# EAGLE design magic-camper-node (EAGLE 5.12)
BOM: EXCLUDE; DATABASE: ./partsdb.txt; DESC: JUMPER; PARTNO: B2B-XH-A(LF)(SN)

## Sheet 1 of 5
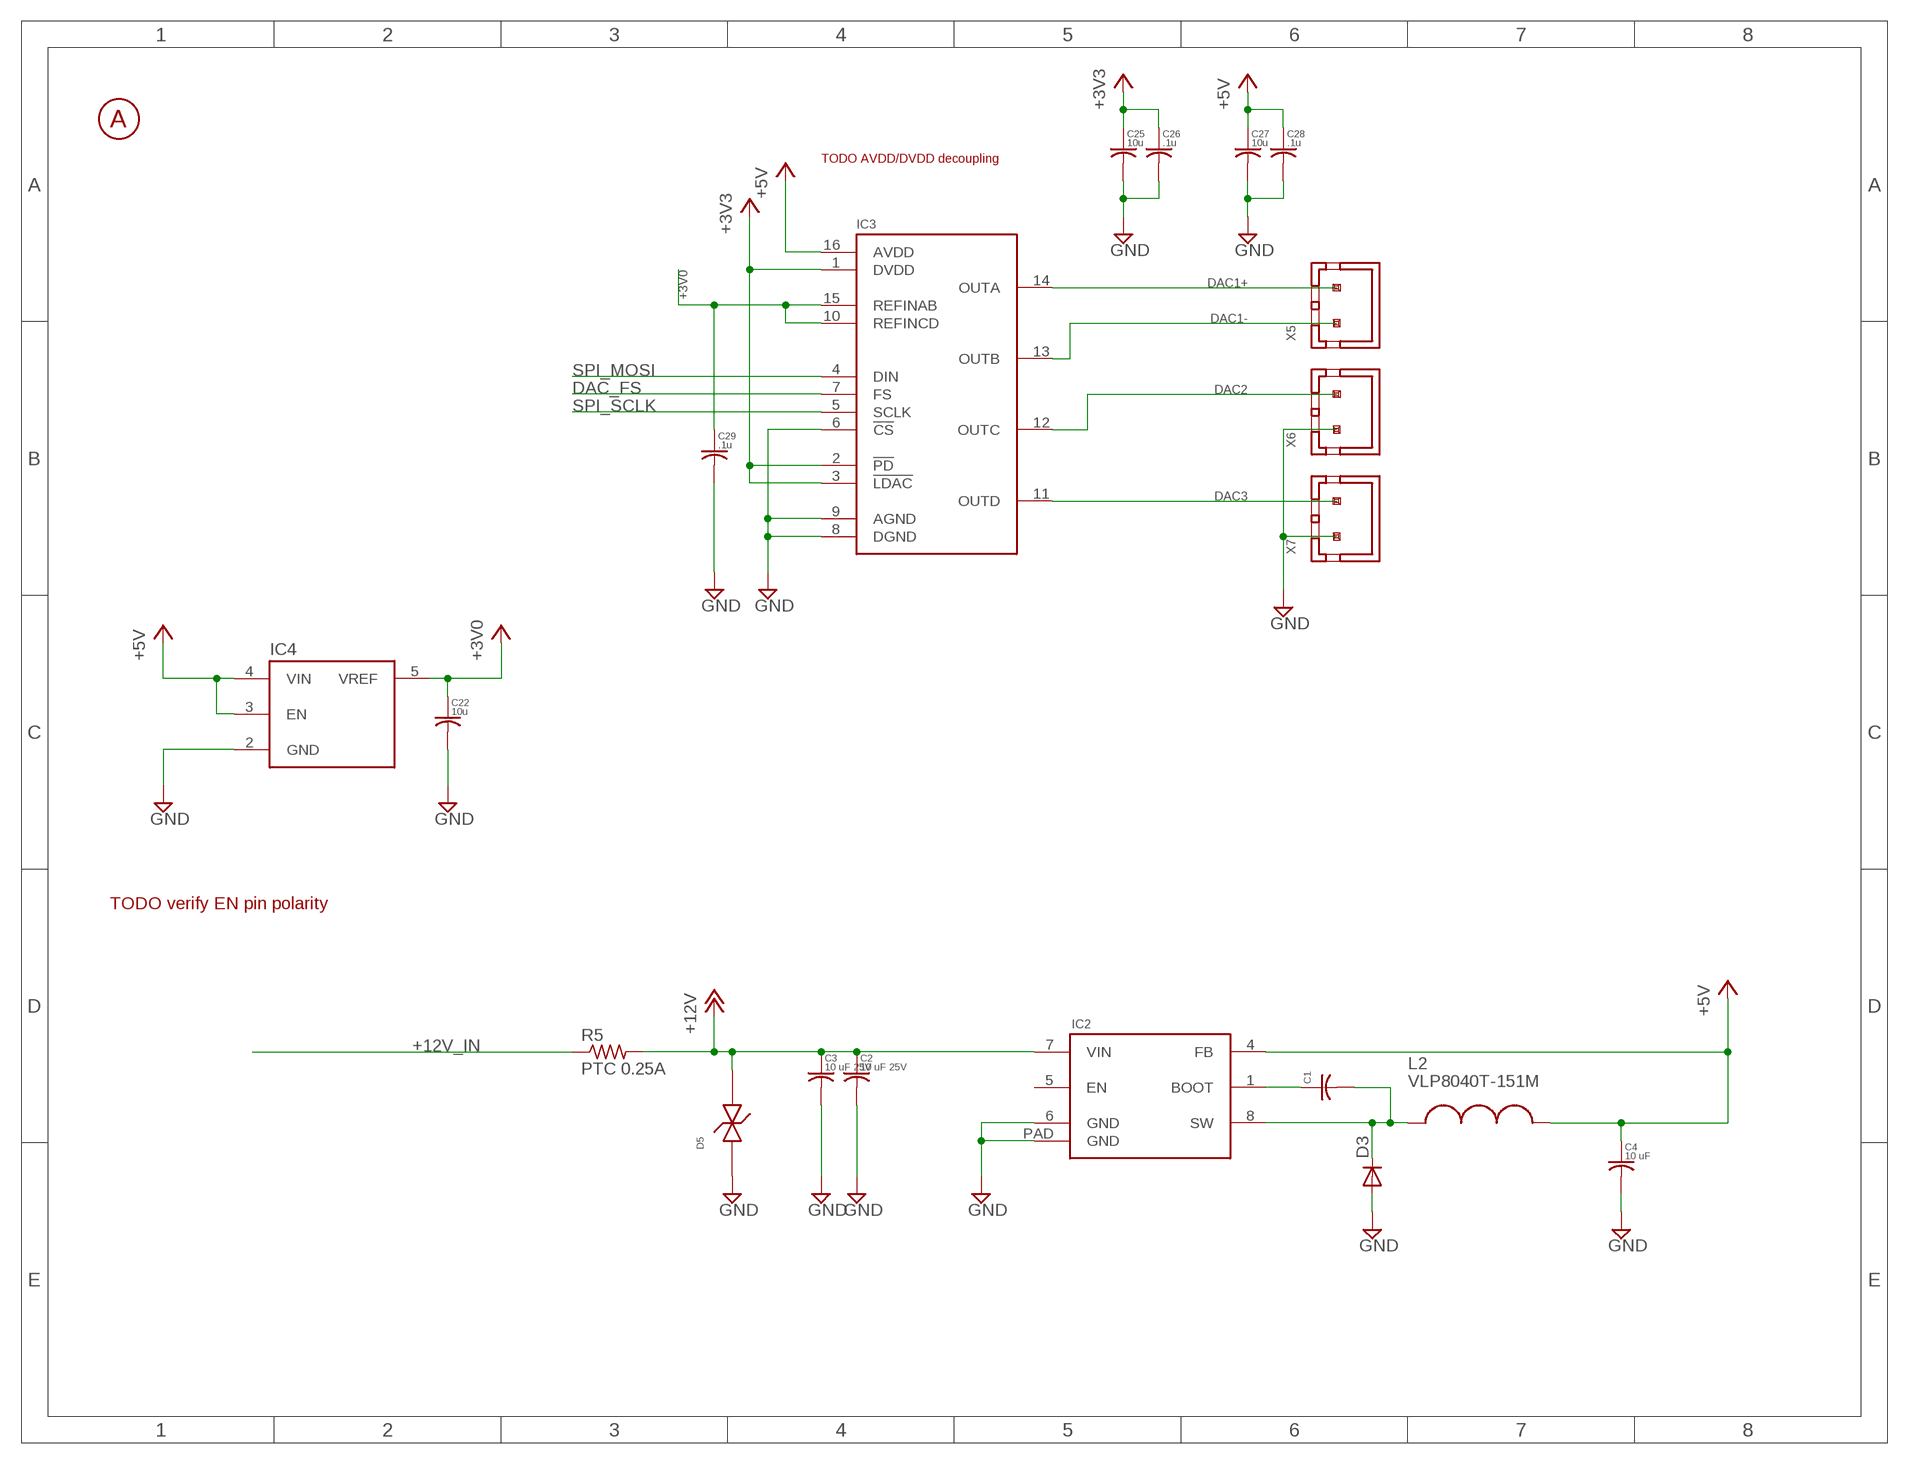
[diagram p0: schematic, sheet 1]

### Parts
C1  C-USC0805  [C0805]
C2  10 uF 25V  C-USC0805  [C0805]
C3  10 uF 25V  C-USC0805  [C0805]
C4  10 uF  C-USC0805  [C0805]
C22  10u  C-USC0805  [C0805]
C25  10u  C-USC0805  [C0805]
C26  .1u  C-USC0603  [C0603]
C27  10u  C-USC0805  [C0805]
C28  .1u  C-USC0603  [C0603]
C29  .1u  C-USC0603  [C0603]
D3  DIODE-SOD123  [SOD123]
D5  SMBJ30CA  [DO-214AA]
IC2  LM22674  [LM22674]
IC3  TLV5614  [SO-16]
IC4  LM4128  [SOT23-5]
L2  VLP8040T-151M  [VLP8040T-151M]
R5  PTC 0.25A  R-US_R0603  [R0603]
U$1  CIRCLE_A-0.3"  [CIRCLE_A-0.25"]
X5  XH-2CKT-VERT  [B2B-XH-A]
X6  XH-2CKT-VERT  [B2B-XH-A]
X7  XH-2CKT-VERT  [B2B-XH-A]

### Nets
+3V0: C22.1 C29.1 IC3.10(REFINCD) IC3.15(REFINAB) IC4.5(VREF) ; also sheet 4
+3V3: C25.1 C26.1 IC3.1(DVDD) IC3.2(!PD) IC3.3(!LDAC) ; also sheet 2,3
+5V: C4.1 C27.1 C28.1 IC2.4(FB) IC3.16(AVDD) IC4.3(EN) IC4.4(VIN) L2.2 ; also sheet 2,3,5
+12V: C2.1 C3.1 D5.2 IC2.7(VIN) R5.2
+12V_IN: R5.1 ; also sheet 3
DAC1+: IC3.14(OUTA) X5.2
DAC1-: IC3.13(OUTB) X5.1
DAC2: IC3.12(OUTC) X6.2
DAC3: IC3.11(OUTD) X7.2
DAC_FS: IC3.7(FS) ; also sheet 2
GND: C2.2 C3.2 C4.2 C22.2 C25.2 C26.2 C27.2 C28.2 C29.2 D3.A D5.1 IC2.6(GND) IC2.PAD(GND) IC3.6(!CS) IC3.8(DGND) IC3.9(AGND) IC4.2(GND) X6.1 X7.1 ; also sheet 2,3,4,5
N$6: C1.2 D3.C IC2.8(SW) L2.1
N$7: C1.1 IC2.1(BOOT)
SPI_MOSI: IC3.4(DIN) ; also sheet 2
SPI_SCLK: IC3.5(SCLK) ; also sheet 2
Unconnected: IC2.5(EN)

### Notes on the sheet
- TODO AVDD/DVDD decoupling
- TODO verify EN pin polarity

## Sheet 2 of 5
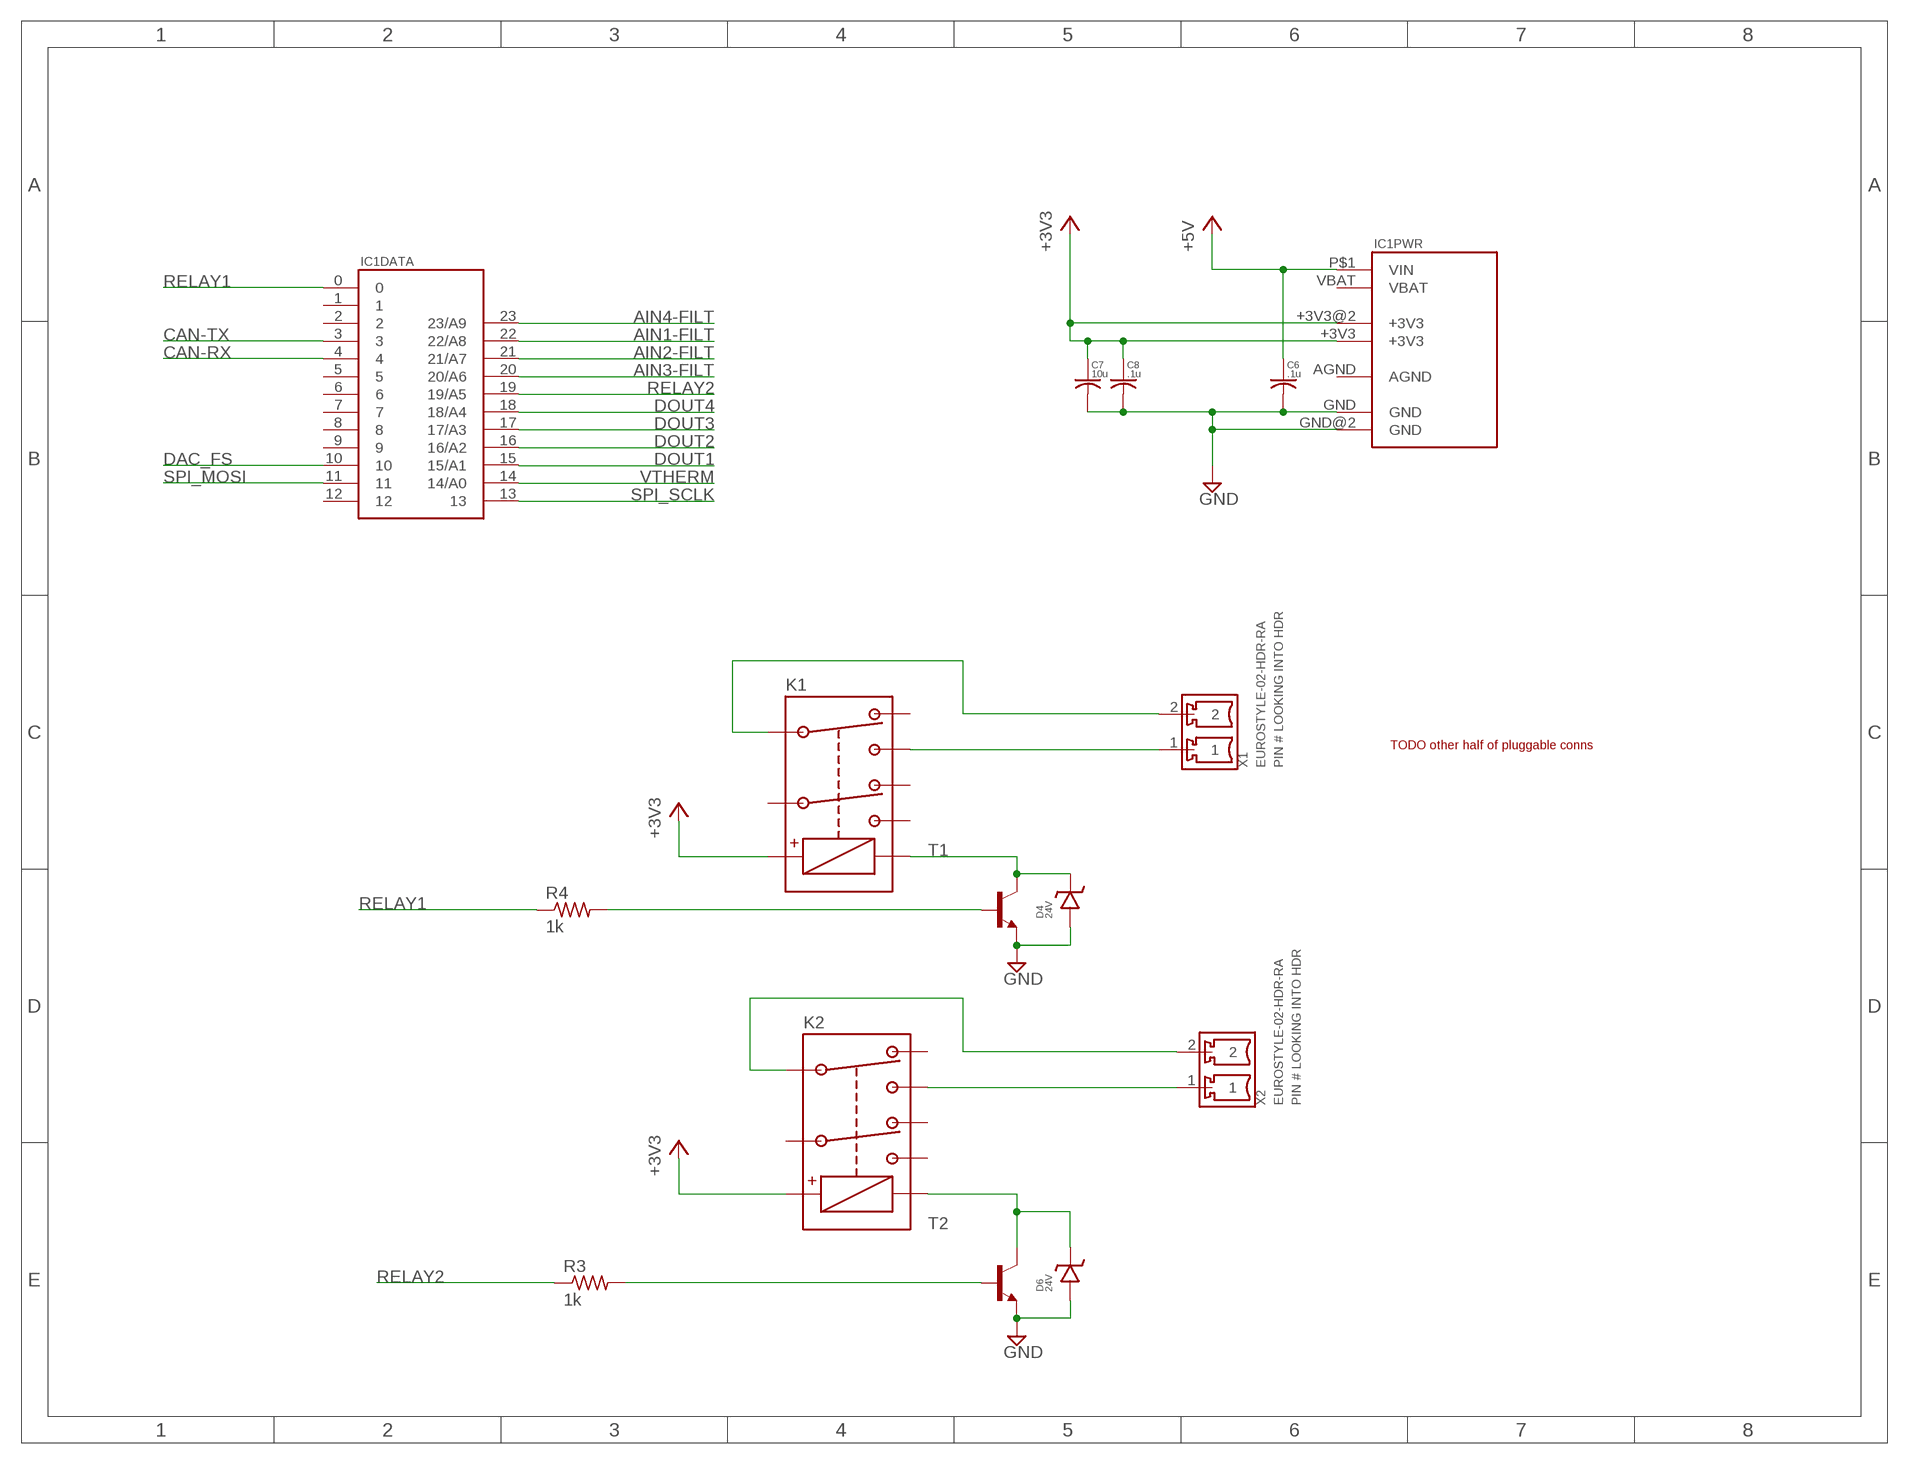
[diagram p1: schematic, sheet 2]

### Parts
C6  .1u  C-USC0603  [C0603]
C7  10u  C-USC0805  [C0805]
C8  .1u  C-USC0603  [C0603]
D4  24V  ZENER_DIODE-SOD-123  [SOD-123]
D6  24V  ZENER_DIODE-SOD-123  [SOD-123]
IC1  TEENSY-3.2  [TEENSY-3.2]
K1  TQ2SA-3V-Z  [TQ2SA-3V-Z]
K2  TQ2SA-3V-Z  [TQ2SA-3V-Z]
R3  1k  R-US_R0603  [R0603]
R4  1k  R-US_R0603  [R0603]
T1  MMBT3904LT1-NPN-SOT23-BEC  [SOT23-BEC]
T2  MMBT3904LT1-NPN-SOT23-BEC  [SOT23-BEC]
X1  EUROSTYLE-02-HDR-RA  [EUROSTYLE_HEADER-2CKT-RA]
X2  EUROSTYLE-02-HDR-RA  [EUROSTYLE_HEADER-2CKT-RA]

### Nets
+3V3: C7.1 C8.1 IC1.+3V3(PWR:+3V3) IC1.+3V3@2(PWR:+3V3) K1.1(COIL+) K2.1(COIL+) ; also sheet 1,3
+5V: C6.1 IC1.P$1(PWR:VIN) ; also sheet 1,3,5
AIN1-FILT: IC1.22(DATA:22/A8) ; also sheet 5
AIN2-FILT: IC1.21(DATA:21/A7) ; also sheet 5
AIN3-FILT: IC1.20(DATA:20/A6) ; also sheet 5
AIN4-FILT: IC1.23(DATA:23/A9) ; also sheet 5
CAN-RX: IC1.4 ; also sheet 3
CAN-TX: IC1.3 ; also sheet 3
DAC_FS: IC1.10 ; also sheet 1
DOUT1: IC1.15(DATA:15/A1) ; also sheet 4
DOUT2: IC1.16(DATA:16/A2) ; also sheet 4
DOUT3: IC1.17(DATA:17/A3) ; also sheet 4
DOUT4: IC1.18(DATA:18/A4) ; also sheet 4
GND: C6.2 C7.2 C8.2 D4.ANODE D6.ANODE IC1.GND(PWR:GND) IC1.GND@2(PWR:GND) T1.E T2.E ; also sheet 1,3,4,5
N$10: K1.3(COM1) X1.2
N$11: K1.4(NO1) X1.1
N$12: K2.3(COM1) X2.2
N$13: K2.4(NO1) X2.1
N$14: D6.CATHODE K2.10(COIL-) T2.C
N$15: D4.CATHODE K1.10(COIL-) T1.C
N$16: R4.2 T1.B
N$17: R3.2 T2.B
RELAY1: IC1.0 R4.1
RELAY2: IC1.19(DATA:19/A5) R3.1
SPI_MOSI: IC1.11 ; also sheet 1
SPI_SCLK: IC1.13 ; also sheet 1
VTHERM: IC1.14(DATA:14/A0) ; also sheet 4
Unconnected: IC1.1 IC1.2 IC1.5 IC1.6 IC1.7 IC1.8 IC1.9 IC1.12 IC1.AGND(PWR:AGND) IC1.RESET(PGM:RESET) IC1.VBAT(PWR:VBAT) K1.2(NC1) K1.7(NO2) K1.8(COM2) K1.9(NC2) K2.2(NC1) K2.7(NO2) K2.8(COM2) K2.9(NC2)

### Notes on the sheet
- TODO other half of pluggable conns

## Sheet 3 of 5
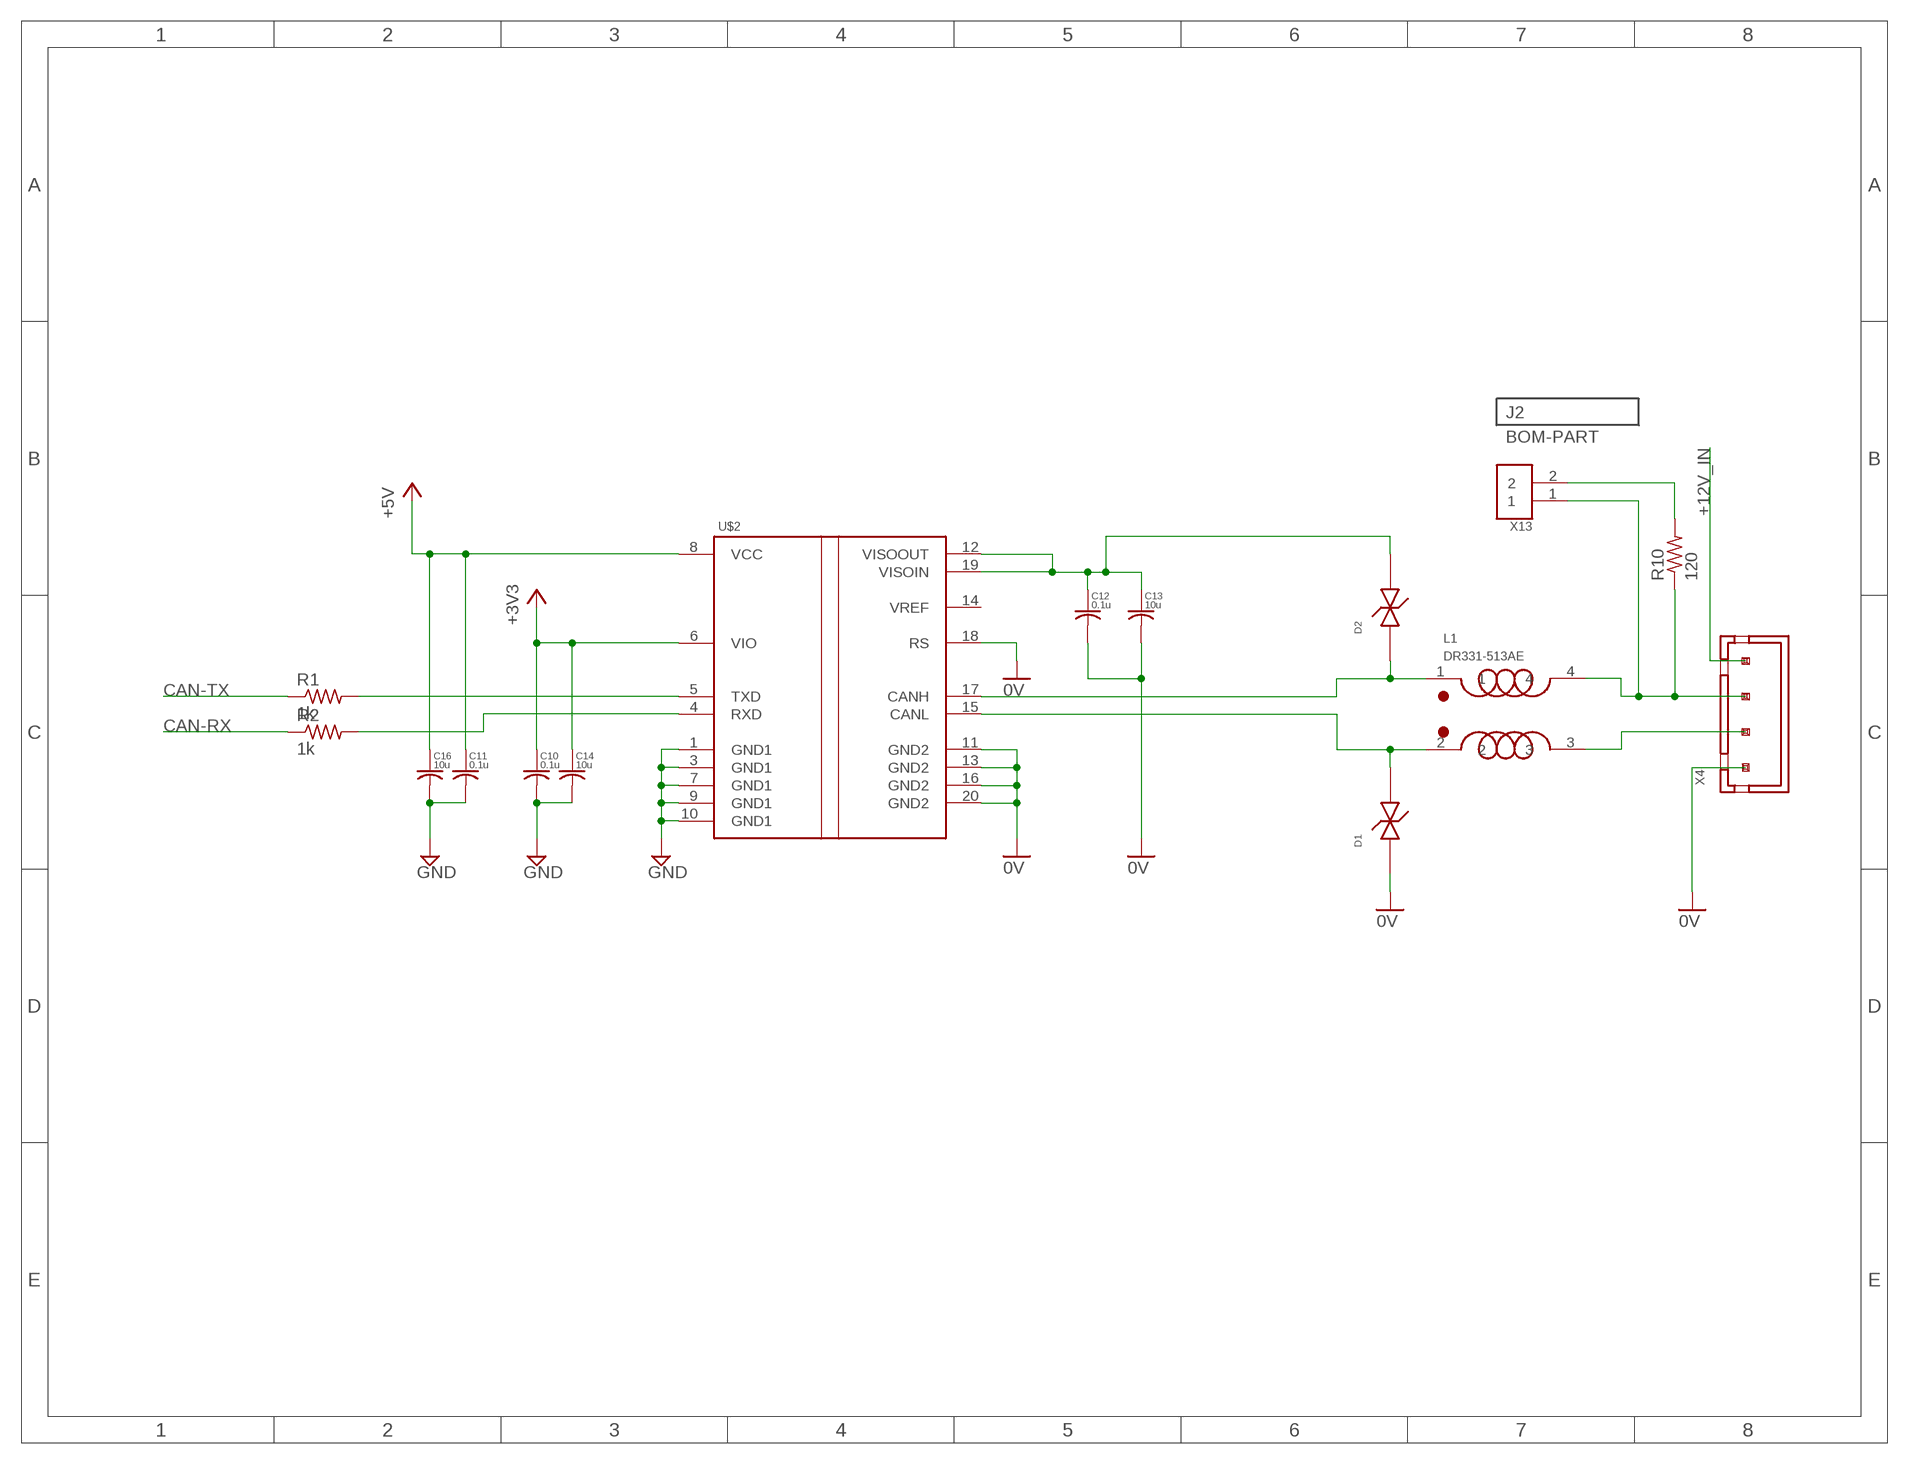
[diagram p2: schematic, sheet 3]
J2 (BOM-PART): BOM: INCLUDE; QTY: 1

### Parts
C10  0.1u  C-USC0603  [C0603]
C11  0.1u  C-USC0603  [C0603]
C12  0.1u  C-USC0603  [C0603]
C13  10u  C-USC0805  [C0805]
C14  10u  C-USC0805  [C0805]
C16  10u  C-USC0805  [C0805]
D1  SMBJ30CA  [DO-214AA]
D2  SMBJ30CA  [DO-214AA]
L1  DR331-513AE  [SMD]
R1  1k  R-US_R0603  [R0603]
R2  1k  R-US_R0603  [R0603]
R10  120  R-US_R0805  [R0805]
U$2  ADM3053  [SOIC-20]
X4  XH-4CKT-RA-THRU  [S4B-XH-A]
X13  MA02-1-0.05"  [HEADER_1.27_2POS]

### Nets
0V: C12.2 C13.2 D1.1 U$2.11(GND2) U$2.13(GND2) U$2.16(GND2) U$2.18(RS) U$2.20(GND2) X4.1
+3V3: C10.1 C14.1 U$2.6(VIO) ; also sheet 1,2
+5V: C11.1 C16.1 U$2.8(VCC) ; also sheet 1,2,5
+12V_IN: X4.4 ; also sheet 1
CAN-RX: R2.1 ; also sheet 2
CAN-TX: R1.1 ; also sheet 2
GND: C10.2 C11.2 C14.2 C16.2 U$2.1(GND1) U$2.3(GND1) U$2.7(GND1) U$2.9(GND1) U$2.10(GND1) ; also sheet 1,2,4,5
N$1: D2.1 L1.1 U$2.17(CANH)
N$2: D1.2 L1.2 U$2.15(CANL)
N$3: C12.1 C13.1 D2.2 U$2.12(VISOOUT) U$2.19(VISOIN)
N$4: R1.2 U$2.5(TXD)
N$5: R2.2 U$2.4(RXD)
N$8: L1.3 X4.2
N$9: L1.4 R10.1 X4.3 X13.1
N$18: R10.2 X13.2
Unconnected: U$2.14(VREF)

## Sheet 4 of 5
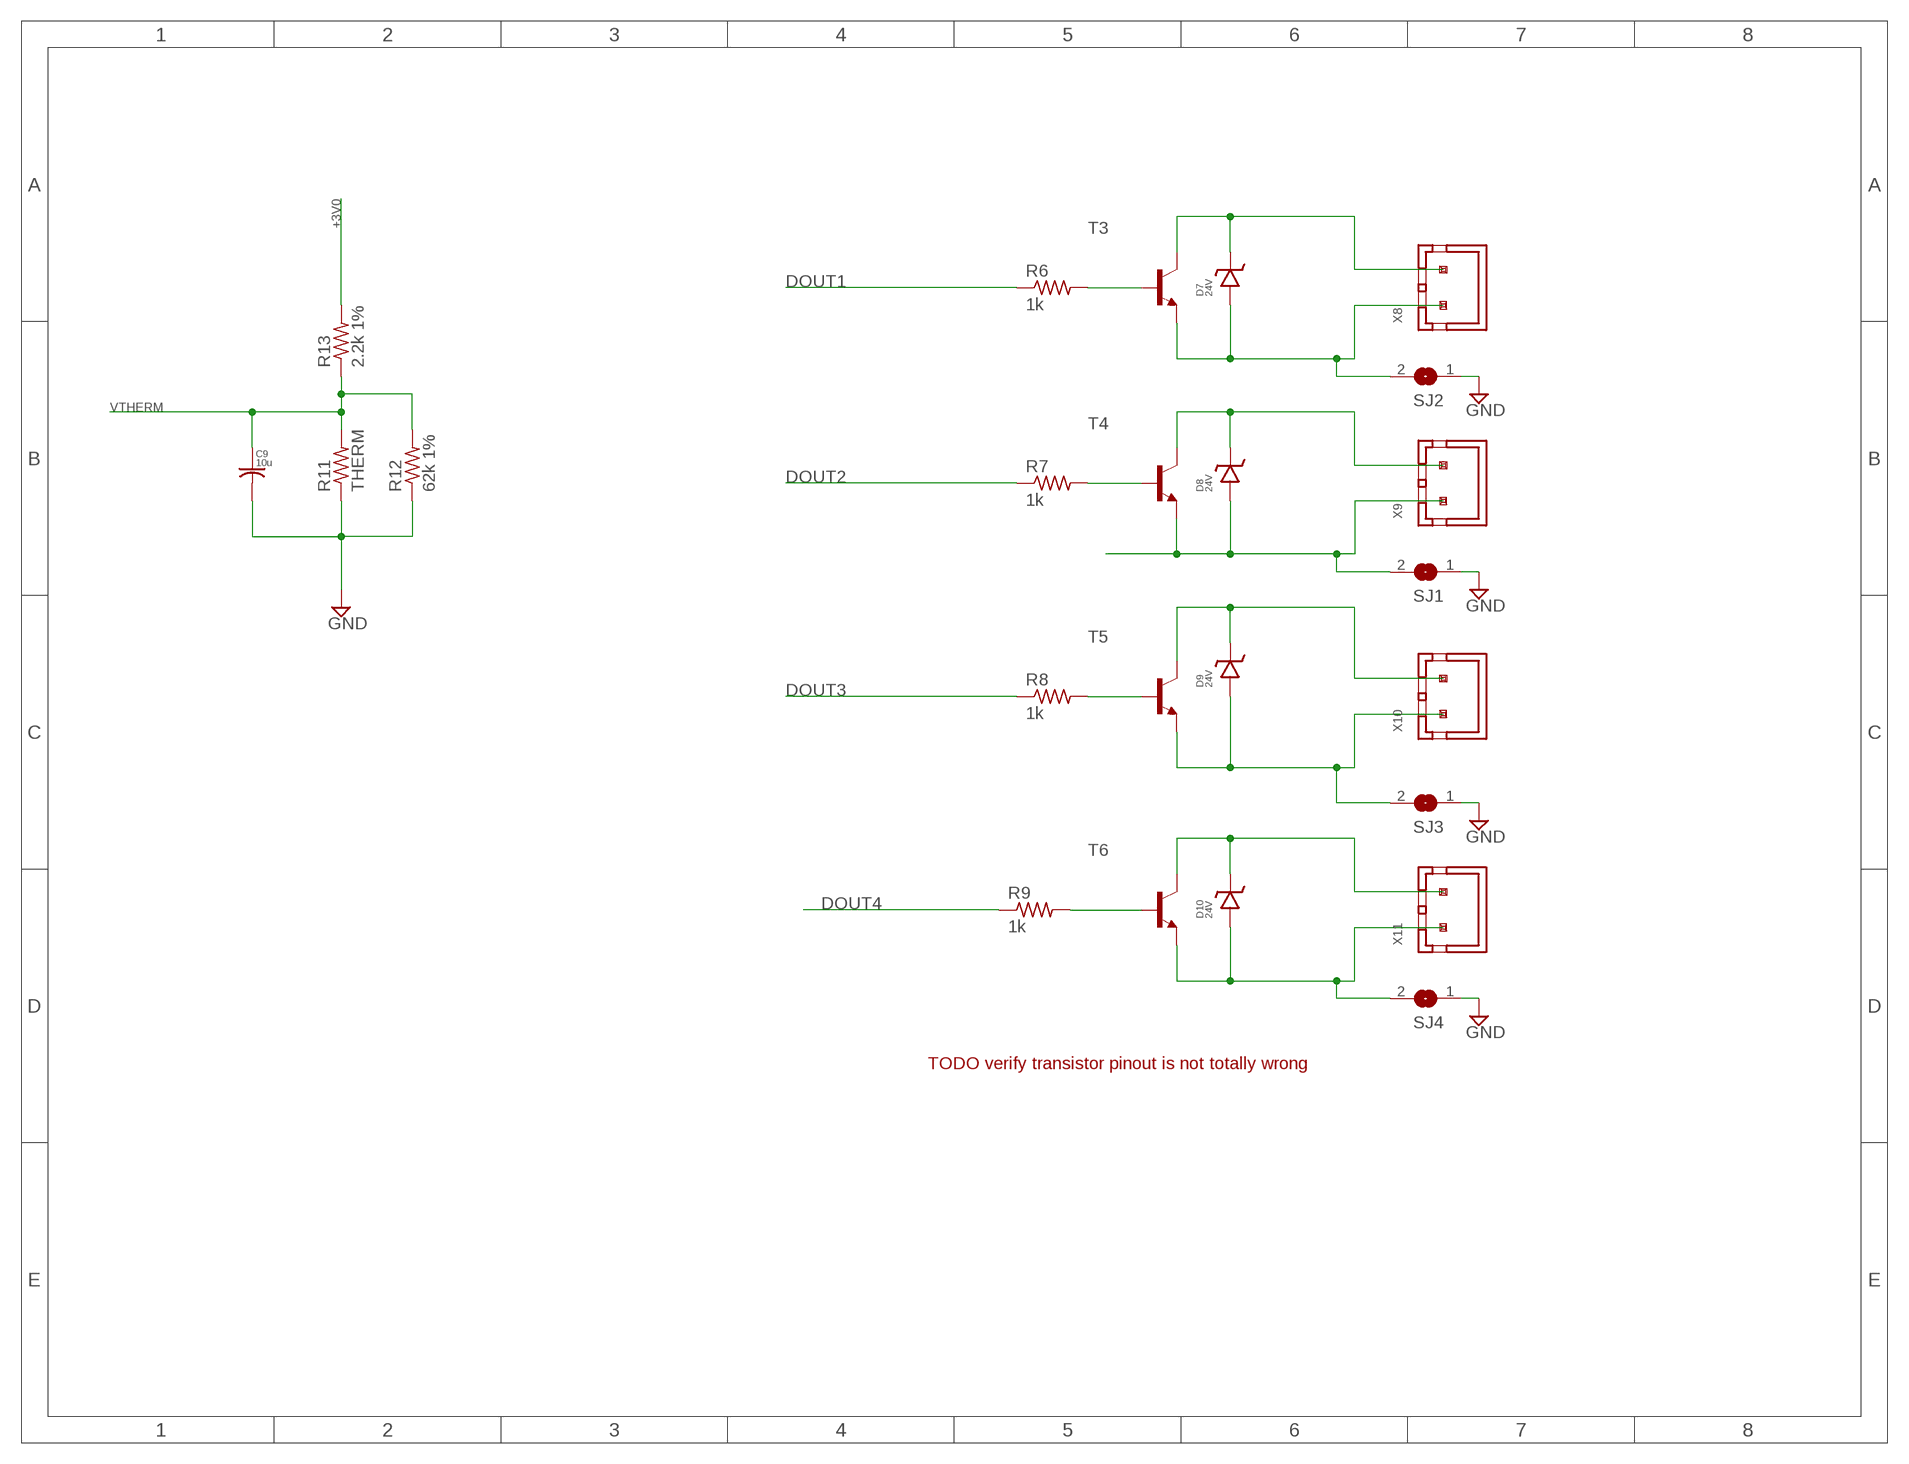
[diagram p3: schematic, sheet 4]

### Parts
C9  10u  C-USC0805  [C0805]
D7  24V  ZENER_DIODE-SOD-123  [SOD-123]
D8  24V  ZENER_DIODE-SOD-123  [SOD-123]
D9  24V  ZENER_DIODE-SOD-123  [SOD-123]
D10  24V  ZENER_DIODE-SOD-123  [SOD-123]
R6  1k  R-US_R0603  [R0603]
R7  1k  R-US_R0603  [R0603]
R8  1k  R-US_R0603  [R0603]
R9  1k  R-US_R0603  [R0603]
R11  THERM  R-US_R0603  [R0603]
R12  62k 1%  R-US_R0603  [R0603]
R13  2.2k 1%  R-US_R0603  [R0603]
SJ1  SJ  [SJ]
SJ2  SJ  [SJ]
SJ3  SJ  [SJ]
SJ4  SJ  [SJ]
T3  -NPN-SOT23-EBC  [SOT23-EBC]
T4  -NPN-SOT23-EBC  [SOT23-EBC]
T5  -NPN-SOT23-EBC  [SOT23-EBC]
T6  -NPN-SOT23-EBC  [SOT23-EBC]
X8  XH-2CKT-VERT  [B2B-XH-A]
X9  XH-2CKT-VERT  [B2B-XH-A]
X10  XH-2CKT-VERT  [B2B-XH-A]
X11  XH-2CKT-VERT  [B2B-XH-A]

### Nets
+3V0: R13.2 ; also sheet 1
DOUT1: R6.1 ; also sheet 2
DOUT2: R7.1 ; also sheet 2
DOUT3: R8.1 ; also sheet 2
DOUT4: R9.1 ; also sheet 2
GND: C9.2 R11.1 R12.1 SJ1.1 SJ2.1 SJ3.1 SJ4.1 ; also sheet 1,2,3,5
N$22: D7.CATHODE T3.C X8.2
N$23: D7.ANODE SJ2.2 T3.E X8.1
N$24: D8.CATHODE T4.C X9.2
N$25: D8.ANODE SJ1.2 T4.E X9.1
N$26: D9.CATHODE T5.C X10.2
N$27: D9.ANODE SJ3.2 T5.E X10.1
N$28: D10.CATHODE T6.C X11.2
N$29: D10.ANODE SJ4.2 T6.E X11.1
N$30: R6.2 T3.B
N$31: R7.2 T4.B
N$32: R8.2 T5.B
N$46: R9.2 T6.B
VTHERM: C9.1 R11.2 R12.2 R13.1 ; also sheet 2

### Notes on the sheet
- TODO verify transistor pinout is not totally wrong

## Sheet 5 of 5
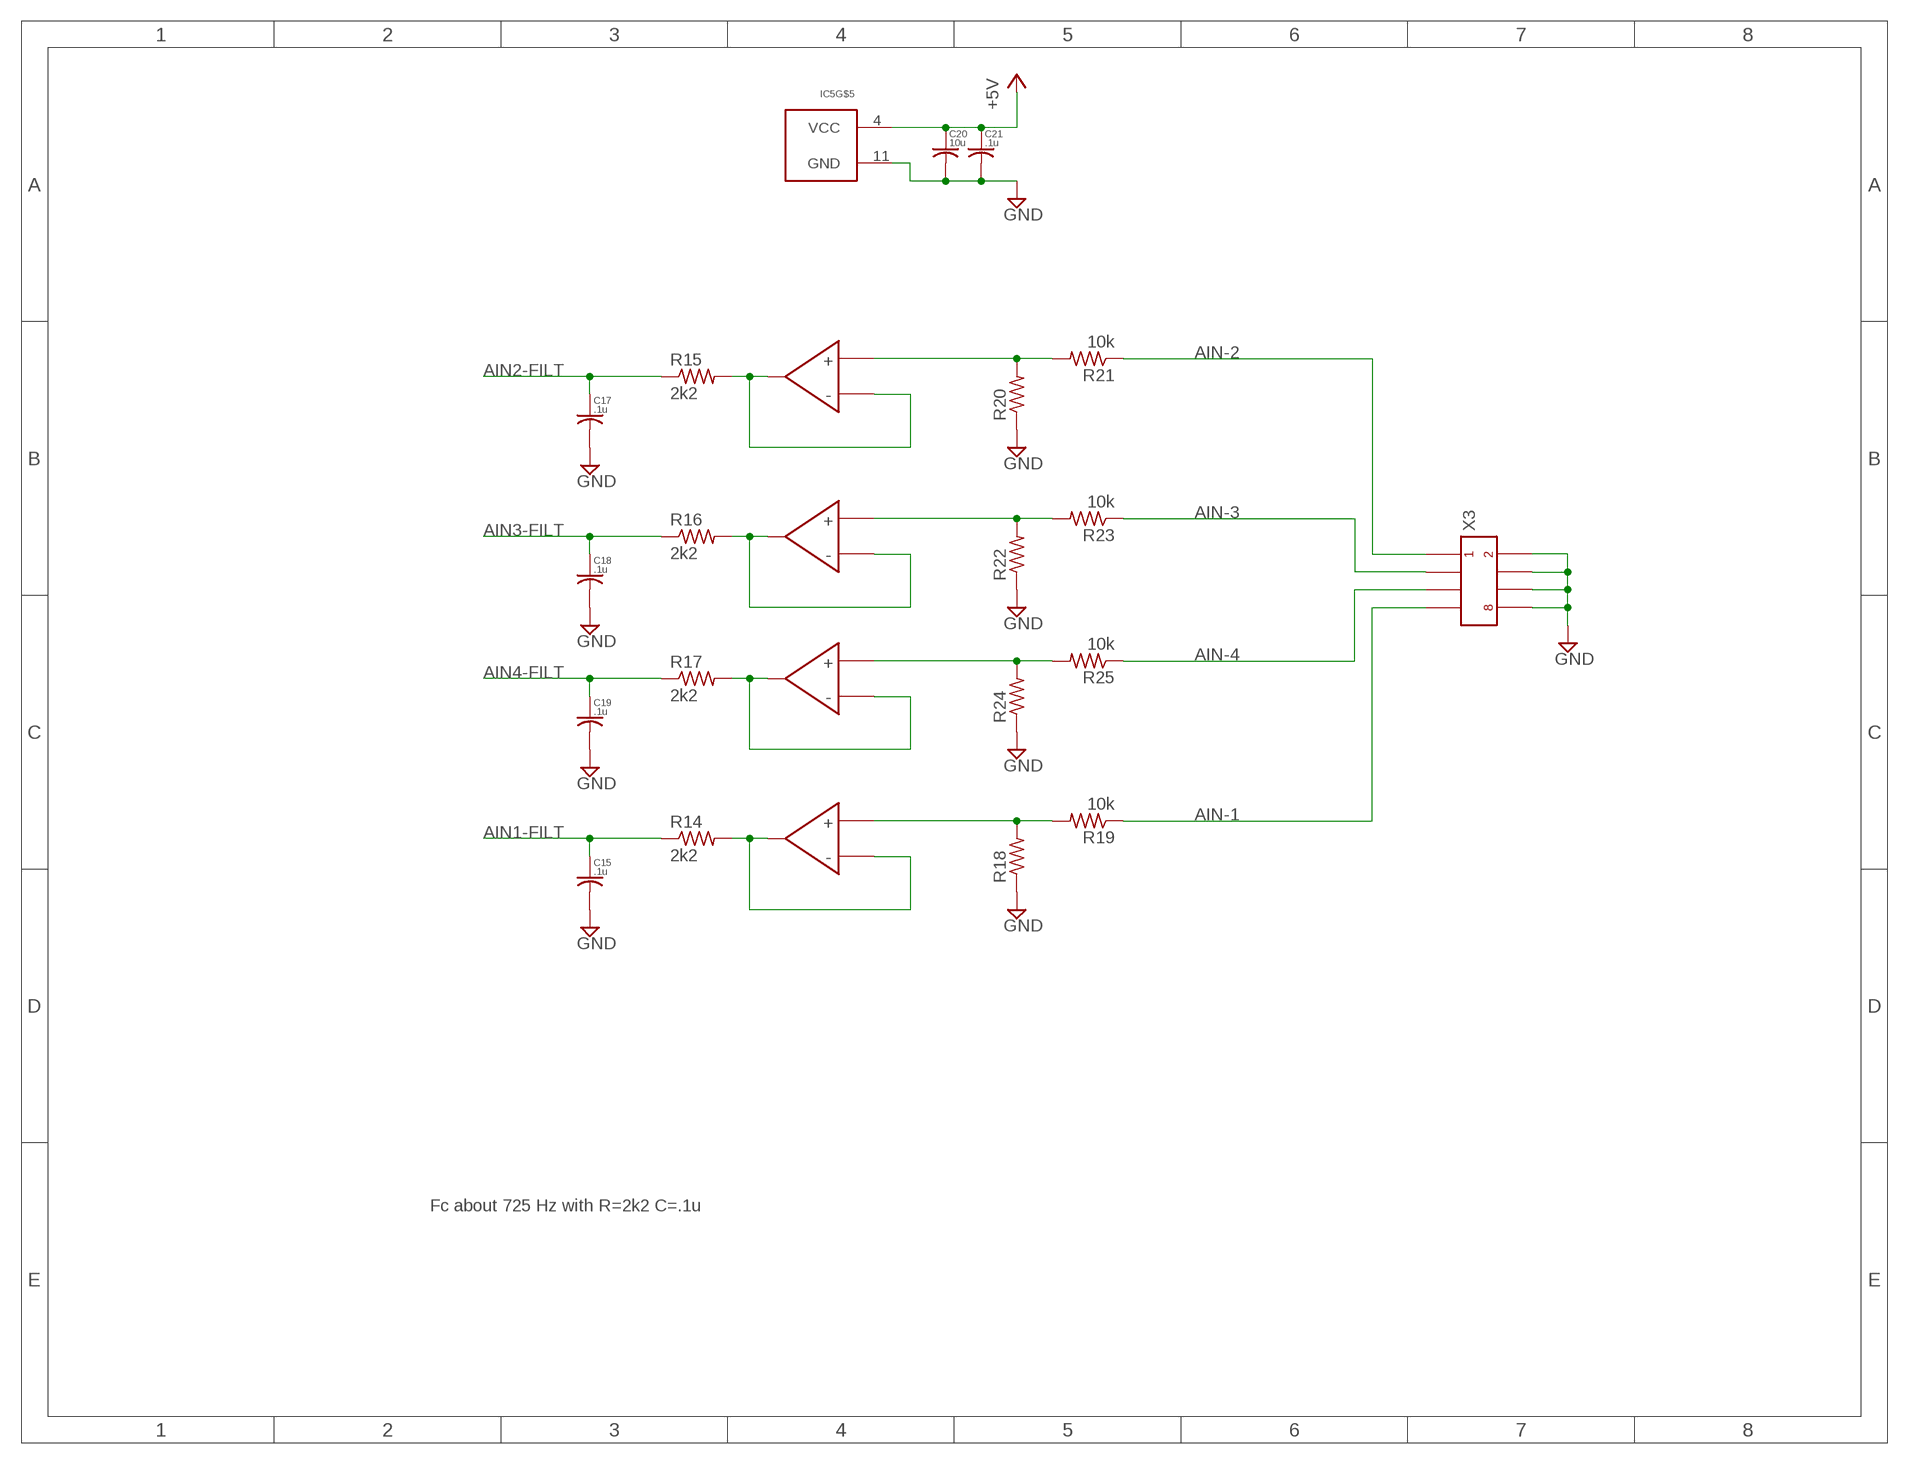
[diagram p4: schematic, sheet 5]

### Parts
C15  .1u  C-USC0603  [C0603]
C17  .1u  C-USC0603  [C0603]
C18  .1u  C-USC0603  [C0603]
C19  .1u  C-USC0603  [C0603]
C20  10u  C-USC0805  [C0805]
C21  .1u  C-USC0603  [C0603]
IC5  TLV2764IPWR  [PW_(R-PDSO-G14)_(TSSOP-14)]
R14  2k2  R-US_R0603  [R0603]
R15  2k2  R-US_R0603  [R0603]
R16  2k2  R-US_R0603  [R0603]
R17  2k2  R-US_R0603  [R0603]
R18  R-US_R0603  [R0603]
R19  10k  R-US_R0603  [R0603]
R20  R-US_R0603  [R0603]
R21  10k  R-US_R0603  [R0603]
R22  R-US_R0603  [R0603]
R23  10k  R-US_R0603  [R0603]
R24  R-US_R0603  [R0603]
R25  10k  R-US_R0603  [R0603]
X3  MALE-HEADER-8POS-2.54-RA-SHROUDED  [75867-132LF]

### Nets
+5V: C20.1 C21.1 IC5.4(VCC) ; also sheet 1,2,3
AIN1-FILT: C15.1 R14.1 ; also sheet 2
AIN2-FILT: C17.1 R15.1 ; also sheet 2
AIN3-FILT: C18.1 R16.1 ; also sheet 2
AIN4-FILT: C19.1 R17.1 ; also sheet 2
AIN-1: R19.1 X3.7
AIN-2: R21.1 X3.1
AIN-3: R23.1 X3.3
AIN-4: R25.1 X3.5
GND: C15.2 C17.2 C18.2 C19.2 C20.2 C21.2 IC5.11(GND) R18.1 R20.1 R22.1 R24.1 X3.2 X3.4 X3.6 X3.8 ; also sheet 1,2,3,4
N$19: IC5.6(IN-) IC5.7(OUT) R15.2
N$20: IC5.1(OUT) IC5.2(IN-) R14.2
N$21: IC5.12(IN+) R24.2 R25.2
N$34: IC5.8(OUT) IC5.9(IN-) R16.2
N$35: IC5.13(IN-) IC5.14(OUT) R17.2
N$36: IC5.10(IN+) R22.2 R23.2
N$37: IC5.5(IN+) R20.2 R21.2
N$38: IC5.3(IN+) R18.2 R19.2

### Notes on the sheet
- Fc about 725 Hz with R=2k2 C=.1u

## Library data of the parts
C1-C4 C6-C22 C25-C29 = rcl:C-US: CAPACITOR, American symbol
D1 D2 D5 = Littelfuse:SMBJ30CA: Bidirectional TVS Zener Diode 30V Breakdown http://www.digikey.com/product-detail/en/SMBJ30CA/SMBJ30CALFCT-ND/286112; PARTNO: SMBJ30CALFCT-ND
D3 = diode:DIODE-: DIODE
D4 D6-D10 = Diodes:ZENER_DIODE
IC1 = counter:TEENSY-3.2
IC2 = counter:LM22674
IC3 = magic-camper-node:TLV5614; PARTNO: TLV5614IPWR
IC4 = magic-camper-node:LM4128
IC5 = TI:TLV2764: TLV2764 - Micropower, Rail-to-Rail Input/Output Op-Amps with Shutdown Datasheet: http://www.ti.com/lit/ds/symlink/tlv2764.pdf; PARTNO: TLV2764IPWR
K1 K2 = magic-camper-node:TQ2SA-3V-Z; PARTNO: TQ2SA-3V-Z
L1 = Bourns:DR331-513AE: Bourns Common Mode Choke; PARTNO: DR331-513AECT-ND
L2 = counter:VLP8040T-151M; PARTNO: VLP8040T-151M
R1-R25 = rcl:R-US_: RESISTOR, American symbol
SJ1-SJ4 = jumper:SJ: SMD solder JUMPER
T1-T6 = transistor:*-NPN-: NPN Transistror BF959 corrected 2008.03.06
U$1 = magic-camper-node:CIRCLE_A
U$2 = counter:ADM3053
X1 X2 = Molex:EUROSTYLE-02-HDR: Eurostyle (tm) 3.50mm Pitch PCB Header, 2 Circuits This is the pluggable screw terminal block that Molex makes (like on the BQ76PL536 EVM boards). Molex series number: 39502 (horizontal header), 39501 (vertical header) Mates with: 39500 horizontal plug, 39503 vertical plug Website (horizontal header): http://www.molex.com/molex/products/datasheet.jsp?part=active/0395021002_TERMINAL_BLOCKS.xml Website (vertical header): http://www.molex.com/molex/products/datasheet.jsp?part=active/0395011002_TERMINAL_BLOCKS.xml Datasheet: http://www.molex.com/pdm_docs/sd/395021006_sd.pdf <http://www.molex.com/pdm_docs/sd/395021004_sd.pdf>
X3 = magic-camper-node:MALE-HEADER-8POS; PARTNO: 75867-132LF
X4 = JST:XH-4CKT: XH connector, 4 circuits Datasheet: http://www.jst-mfg.com/product/pdf/eng/eXH.pdf; PARTNO: S4B-XH-A
X5-X11 = JST:XH-2CKT: XH connector, 2 circuits Datasheet: http://www.jst-mfg.com/product/pdf/eng/eXH.pdf Mating connector: XHP-2 Terminals: SXH-001T-P0.6 (28-22awg) SXH-002T-P0.6 (30-26awg); PARTNO: B2B-XH-A
X13 = magic-camper-node:MA02-1; PARTNO: GRPB021VWVN-RC

## Board
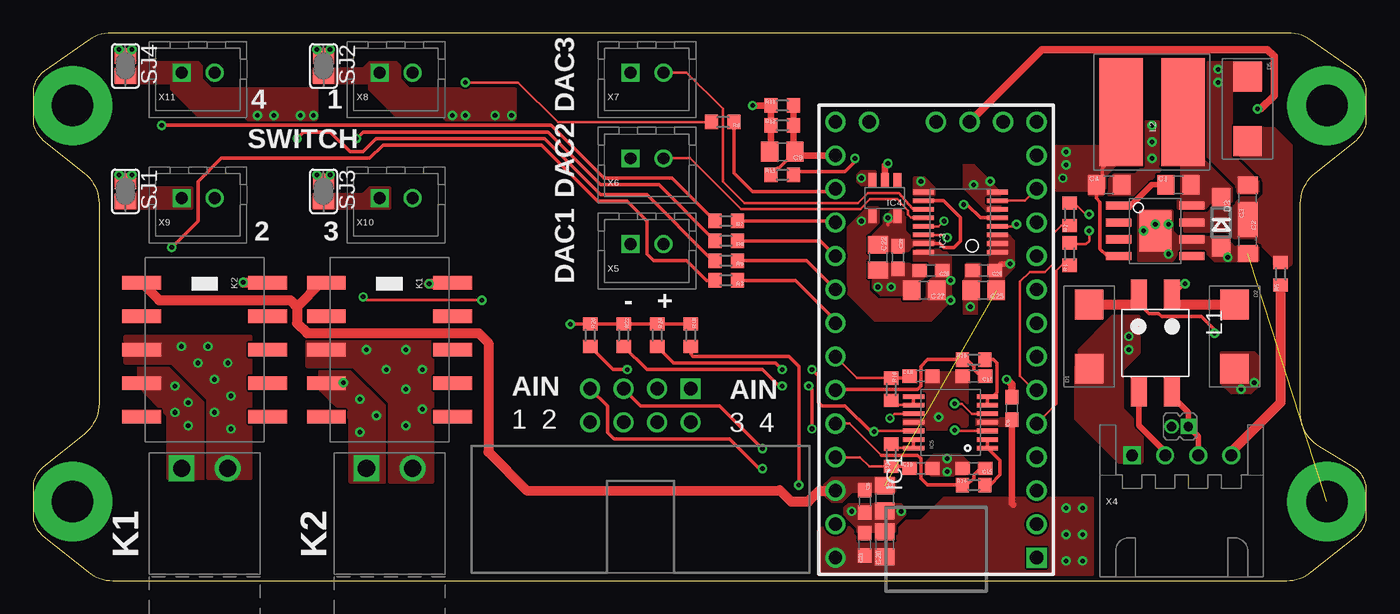
[diagram p5: board, top side]
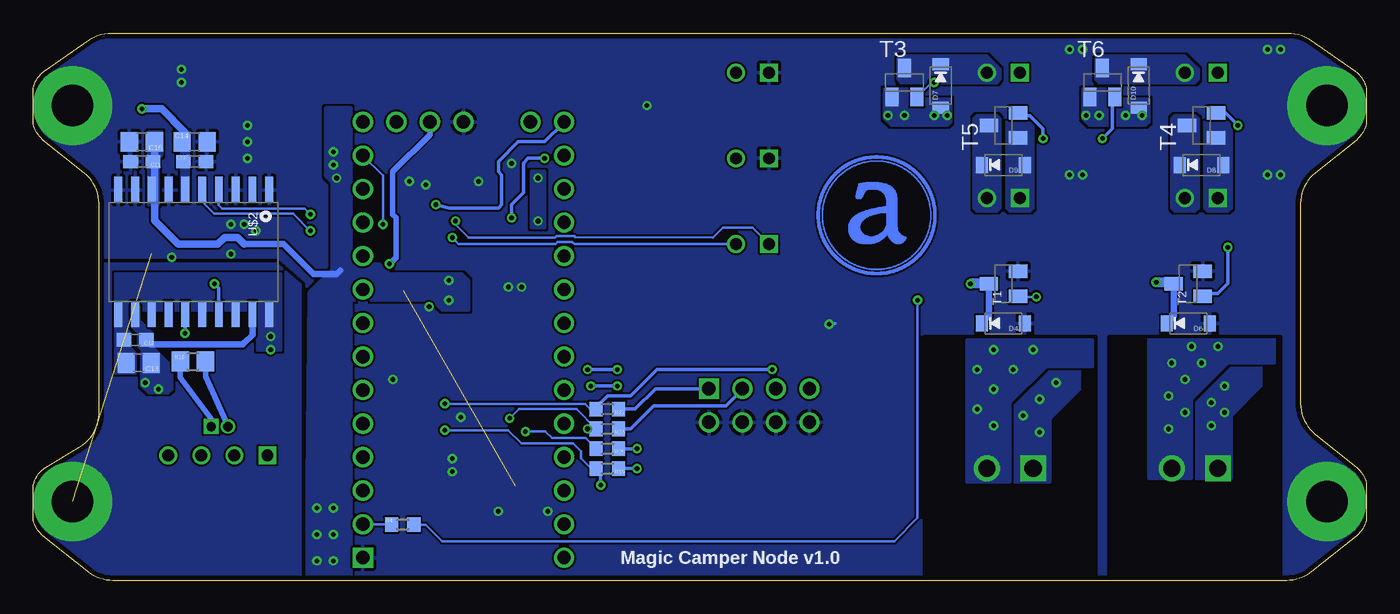
[diagram p6: board, bottom side, seen from below]

Size 101 x 41.5 mm. Coordinates in mm from the lower left corner, seen from the top.
Outline: 94.95,0 arc39 96.82,0.66 100.25,3.4 arc51 101,4.96 101,6.87 arc59 100.03,8.58 97.46,10.13 arc-59 96,12.7 96,28.56 arc-51 97.13,30.9 100.25,33.4 arc51 101,34.96 101,36.96 arc55 100.15,38.6 96.78,40.96 arc35 95.05,41.5 5.95,41.5 arc35 4.22,40.96 0.85,38.6 arc55 0,36.96 0,34.96 arc51 0.75,33.4 3.87,30.9 arc-51 5,28.56 5,13.44 arc-51 3.87,11.1 0.75,8.6 arc51 0,7.04 0,4.96 arc51 0.75,3.4 4.18,0.66 arc39 6.05,0 94.95,0
Copper layers (1*16): Top 0.0356mm / dielectric 1.5011mm / Bottom 0.0356mm
Design rules "OSH Park 2-layer *": minimum track width 6mil, minimum drill 13mil, track to track 6mil, track to pad 6mil, pad to pad 6mil, via to via 6mil, smd to smd 0mil, copper to edge 15mil, drill to drill 6mil, minimum pad ring 7mil, minimum via ring 7mil, stop-mask expansion 4mil, vias tented up to drill 25mil, thermal gap 10mil
bRestrict: 9 lines

### Footprints (pad centres in the part's own frame; a part is rotated, then mirrored left to right if it is on the bottom)
C0805 = smd 1.3 x 1.5: 1 -0.95,0; 2 0.95,0
C0603 = smd 1.1 x 1: 1 -0.85,0; 2 0.85,0
DO-214AA = smd 2.261 x 2.159: 1 -2.438,0; 2 2.438,0
SOD123 = smd 1.4 x 1.4: A 1.9,0; C -1.9,0
SOD-123 = smd 0.91 x 1.22: ANODE -1.64,0; CATHODE 1.64,0
TEENSY-3.2 = drill 1.016 round: 0 3.81,-7.62; 1 6.35,-7.62; 2 8.89,-7.62; 3 11.43,-7.62; 4 13.97,-7.62; 5 16.51,-7.62; 6 19.05,-7.62; 7 21.59,-7.62; 8 24.13,-7.62; 9 26.67,-7.62; 10 29.21,-7.62; 11 31.75,-7.62; 12 34.29,-7.62; 13 34.29,7.62; 14 31.75,7.62; 15 29.21,7.62; 16 26.67,7.62; 17 24.13,7.62; 18 21.59,7.62; 19 19.05,7.62; 20 16.51,7.62; 21 13.97,7.62; 22 11.43,7.62; 23 8.89,7.62; +3V3 34.29,-2.54; +3V3@2 6.35,7.62; AGND 3.81,7.62; GND@2 34.29,0; P$1 1.27,7.62; RESET 34.29,5.08; VBAT 34.29,-5.08 | drill 1.016 square: GND 1.27,-7.62
LM22674 = smd 0.61 x 1.905: 1 -1.905,-2.781; 2 -0.635,-2.781; 3 0.635,-2.781; 4 1.905,-2.781; 5 1.905,2.781; 6 0.635,2.781; 7 -0.635,2.781; 8 -1.905,2.781 | smd 3.099 x 2.413: PAD 0,0
SO-16 = smd 0.35 x 1.6: 1 -2.275,-2.8; 2 -1.625,-2.8; 3 -0.975,-2.8; 4 -0.325,-2.8; 5 0.325,-2.8; 6 0.975,-2.8; 7 1.625,-2.8; 8 2.275,-2.8; 9 2.275,2.8; 10 1.625,2.8; 11 0.975,2.8; 12 0.325,2.8; 13 -0.325,2.8; 14 -0.975,2.8; 15 -1.625,2.8; 16 -2.275,2.8
SOT23-5 = smd 0.6 x 1.05: 1 -0.95,-1.35; 2 0,-1.35; 3 0.95,-1.35; 4 0.95,1.35; 5 -0.95,1.35
PW_(R-PDSO-G14)_(TSSOP-14) = smd 0.35 x 1.6: 1 -1.95,-2.8; 2 -1.3,-2.8; 3 -0.65,-2.8; 4 0,-2.8; 5 0.65,-2.8; 6 1.3,-2.8; 7 1.95,-2.8; 8 1.95,2.8; 9 1.3,2.8; 10 0.65,2.8; 11 0,2.8; 12 -0.65,2.8; 13 -1.3,2.8; 14 -1.95,2.8
TQ2SA-3V-Z = smd 1 x 2.94: 1 -5.08,-4.78; 2 -2.54,-4.78; 3 0,-4.78; 4 2.54,-4.78; 5 5.08,-4.78; 6 5.08,4.78; 7 2.54,4.78; 8 0,4.78; 9 -2.54,4.78; 10 -5.08,4.78
SMD = smd 2.21 x 1.2: 1 -3.7,1.25; 2 -3.7,-1.25; 3 3.7,-1.25; 4 3.7,1.25
VLP8040T-151M = smd 3.3 x 8.2: 1 -2.35,0; 2 2.35,0
R0603 = smd 1 x 1.1: 1 -0.85,0; 2 0.85,0
R0805 = smd 1.3 x 1.5: 1 -0.95,0; 2 0.95,0
SJ = smd 1.168 x 1.6: 1 -0.762,0; 2 0.762,0
SOT23-BEC = smd 1 x 1.4: B -0.95,-1.1; C 0,1.1; E 0.95,-1.1
SOT23-EBC = smd 1 x 1.4: B 0.95,-1.1; C 0,1.1; E -0.95,-1.1
SOIC-20 = smd 0.6 x 2: 1 0,-4.7; 2 1.27,-4.7; 3 2.54,-4.7; 4 3.81,-4.7; 5 5.08,-4.7; 6 6.35,-4.7; 7 7.62,-4.7; 8 8.89,-4.7; 9 10.16,-4.7; 10 11.43,-4.7; 11 11.43,4.7; 12 10.16,4.7; 13 8.89,4.7; 14 7.62,4.7; 15 6.35,4.7; 16 5.08,4.7; 17 3.81,4.7; 18 2.54,4.7; 19 1.27,4.7; 20 0,4.7
EUROSTYLE_HEADER-2CKT-RA = drill 1.3 square: 1 -1.75,0 | drill 1.3 round: 2 1.75,0
75867-132LF = drill 1.02 square: 1 3.81,2.54 | drill 1.02 round: 2 3.81,0; 3 1.27,2.54; 4 1.27,0; 5 -1.27,2.54; 6 -1.27,0; 7 -3.81,2.54; 8 -3.81,0
S4B-XH-A = drill 0.9 square: 1 -3.75,0 | drill 0.9 round: 2 -1.25,0; 3 1.25,0; 4 3.75,0
B2B-XH-A = drill 0.9 square: 1 -1.25,0 | drill 0.9 round: 2 1.25,0
HEADER_1.27_2POS = drill 0.711 pad 1.143 square: 1 -0.635,0 | drill 0.711 pad 1.016 round: 2 0.635,0

### Placement (x,y rotation side)
C1  86.75,30 0 top
C2  92,25.75 270 top
C3  92,29 90 top
C4  81.5,30 0 top
C6  74.14,13.05 90 top
C7  64.5,6.25 270 top
C8  63,6 270 top
C9  56.75,32.5 180 top
C10  88.75,31.75 0 bottom
C11  92.75,31.75 180 bottom
C12  93.25,18.25 180 bottom
C13  93,16.5 180 bottom
C14  88.75,33.25 0 bottom
C15  71.25,8.5 180 top
C16  92.75,33.25 180 bottom
C17  71.25,15.5 180 top
C18  67.25,15.5 0 top
C19  67.25,8.5 0 top
C20  64.5,2.75 90 top
C21  63,2.75 90 top
C22  64,24.5 270 top
C25  72,22 180 top
C26  72,23.5 180 top
C27  67.5,22 180 top
C28  68,23.5 180 top
C29  65.5,24.5 270 top
D1  80,18.5 90 top
D2  91,18.5 270 top
D3  90,27.15 270 top
D4  27.5,19.5 180 bottom
D5  92,35.75 270 top
D6  13.5,19.5 180 bottom
D7  32.25,37.5 90 bottom
D8  12.5,31.5 180 bottom
D9  27.5,31.5 180 bottom
D10  17.25,37.5 90 bottom
IC1  68.4,0.47 90 top
IC2  85,26.5 270 top
IC3  70.23,27.17 90 top
IC4  64.52,28.99 180 top
IC5  69.5,12 90 top
K1  27,17.5 270 top
K2  13,17.5 270 top
L1  85,18 270 top
L2  84.75,35.5 180 top
R1  78.5,24.75 90 top
R2  78.5,27.75 90 top
R3  52.5,22.75 180 top
R4  73,4.25 0 bottom
R5  94.5,23.25 90 top
R6  52.25,34.75 180 top
R7  52.5,27.25 180 top
R8  52.5,25.75 180 top
R9  52.5,24.25 180 top
R10  88.89,16.61 0 bottom
R11  56.75,36 0 top
R12  56.75,34.5 0 top
R13  56.75,30.75 0 top
R14  71.25,7.25 0 top
R15  71.25,16.75 0 top
R16  65,14.5 270 top
R17  65,9.5 90 top
R18  49.82,18.6 270 top
R19  57.5,8.5 180 bottom
R20  42.2,18.6 270 top
R21  57.5,13 180 bottom
R22  44.74,18.6 270 top
R23  57.5,11.5 180 bottom
R24  47.28,18.6 270 top
R25  57.5,10 180 bottom
SJ1  7,29.5 270 top
SJ2  22,39 270 top
SJ3  22,29.5 270 top
SJ4  7,39 270 top
T1  27.5,22.5 90 bottom
T2  13.5,22.5 90 bottom
T3  35,37.75 0 bottom
T4  12.5,34.5 90 bottom
T5  27.5,34.5 90 bottom
T6  20,37.75 0 bottom
U$1  41.75,23 0 bottom
U$2  83.11,24.91 180 bottom
X1  27,8.5 0 top
X2  13,8.5 0 top
X3  46,12 0 top
X4  87,9.5 0 top
X5  46.5,25.5 0 top
X6  46.5,32 0 top
X7  46.5,38.5 0 top
X8  27.5,38.5 0 top
X9  12.5,29 0 top
X10  27.5,29 0 top
X11  12.5,38.5 0 top
X13  86.87,11.68 180 top

### Tracks (layer width: path | path; a pad name or v marks a point on that pad's centre or on a via)
0V  (via drill 0.35)
  other vias: 83,18.5 83,17.5
  pour Top (rank 2, no thermals): 79.25,15.25 79.25,17.5 81.75,20 83.75,20 83.75,17.25 81.75,15.25
  pour Bottom (rank 2, no thermals): 82.25,23.25 82.25,17.5 84,17.5 84,20.5 93.75,20.5 93.75,17.75 93.25,17.25 93.25,15.75 94.75,15.75 94.75,23.25
  pour Top (no thermals): 84,9 84,11.5 82.5,13 82.5,16.25 79,16.25 79,12.25 82.25,9
+3V0  (via drill 0.35)
  Top 0.25: IC3.10 68.95,28.8 70.25,27.5 70.25,25.75 69.75,25.25 69,25.25 68.7,25.55 IC3.15 | R13.2 57.85,31 61.5,31 62.25,31.75 v62.25,32 | 64.75,27.25 64.75,27 | 64.75,27.25 arc60 65,27.25 v64.75,27.5 64.75,27.25
  Bottom 0.25: v62.25,32 63.5,32 63.85,31.65 63.85,29.4 64.75,28.5 v64.75,27.5
  pour Top (rank 2, no thermals): 68.25,25.75 66.75,25.75 66,26.5 66,27.75 65.75,28 65.25,28 65,28 64.5,27.5 64.5,27 63.5,26 63.5,25 66,25 66.25,25 66.75,25.5 68.25,25.5
+3V3  (via drill 0.35)  (1 unrouted)
  Top 0.4: v74,24 73.35,24 C26.1
  Top 0.55: IC1.+3V3 76.43,40.25 93.5,40.25 94,39.75 94,36.75 93,35.75 v92.75,35.75
  Top 0.75: IC1.+3V3@2 59.57,6.82 58.75,6 57.42,6 56.56,6.86 37.43,6.82 34.5,9.75 34.5,18 33.75,18.75 20.75,18.75 20,19.5 20,20.75 | 20,20.75 19.5,21.25 9.55,21.25 K2.1 | K1.1 21.83,22.58 20,20.75
  Bottom 0.4: IC1.+3V3 70.94,33.81 73.75,31 73.75,27.75 73.5,27.5 73.5,24.5 v74,24
  Bottom 0.55: v92.75,35.75 91.25,35.75 89.5,34 89.5,33.75 89.75,33.5 89.75,33.25 C14.1
  pour Bottom (no thermals): 89.25,28.75 89.75,28.75 89.75,34 89.25,34
  pour Top (rank 2, no thermals): 72.5,26.25 72.5,21.5 73.5,21.5 73.5,23 74.25,23.75 74.25,24.5 74.25,25.75 73.75,26.25
  pour Top (rank 3, no thermals): 65.25,6.75 62,6.75 61.25,6 60.5,6 60,6.5 60,7.25 60.25,7.5 60.5,7.75 65.25,7.75
+5V  (via drill 0.35)
  Top 0.25: L2.2 82.4,34.85 82.5,34.75 82.5,32.75 81,31.25 81,30.45 C4.1 80.55,28.97 80.82,28.7 80.82,25.15 81.33,24.64 81.61,24.64 81.75,24.5 | 81.75,24.5 82.12,24.5 IC2.4 | 81.75,24.5 81.5,24.5
  Top 0.5: C6.1 74.14,5.86 74.25,5.75
  Bottom 0.5: 85,25.5 82,25.5 79.75,23.25 78,23.25 77.75,23.5
  Bottom 0.55: C16.1 91.8,27.3 90,25.5 87,25.5 86.5,26 85.5,26 85,25.5
  other vias: 78.25,5.5 79.5,5.5 78.25,3.5 79.5,3.5 79.5,1.5 78.25,1.5 62.75,30.5 62.75,27.25 69.5,22.75 69.5,21.25 78.25,32.5 78.25,31.5 78,30.5
  pour Bottom (no thermals): 77,35.75 78.75,35.75 78.75,30.75 78.25,30.25 78.25,23.5 80,21.75 80.25,0.25 77,0.25
  pour Bottom (no thermals): 92.25,28.5 92.25,34 91.25,34 91.25,32.5 91.25,32.25 91.5,32 91.5,28.5
  pour Top (rank 3, no thermals): 66.75,25 69,25 69.5,24.5 69.5,21.25 68,19.75 63.75,19.75 61.75,21.75 61.75,26.75 63.25,28.25 64,28.25 64,26.75 63.25,26 63.25,22 64,21.25 67.5,21.25 67.75,21.5 67.75,22.5 68.5,23.25 68.5,23.75 68.25,24 67,24 66.75,24.25
  pour Top (rank 3, no thermals): 80.25,6.25 69,6.25 67.25,4.5 60.25,4.5 59.5,3.75 59.5,0.5 80.25,0.5
  pour Top (rank 3, no thermals): 74.5,12.25 71.5,12.25 71.5,11.75 74.5,11.75
  pour Top (rank 2, no thermals): 81,29.25 81,30.75 81.75,31.5 81.75,32.75 80.75,32.75 80,32 80,29.25
  pour Bottom (no thermals): 62.25,31 62.25,26.75 63.25,26.75 63.25,31
  pour Top (no thermals): 63.75,31 62.75,31 62.5,30.75 62.5,30.25 62.75,30 63.75,30
  pour Bottom (rank 2, no thermals): 77.5,24 74.75,24 74,23.25 69.25,23.25 68.5,23.25 68,22.75 68,20.5 70,20.5 70.75,21.25 78.25,21.25 78.25,24
  pour Top (rank 2, no thermals): 82.75,32.75 77.5,32.75 77.5,29.75 81,29.75 81,30.75 82.25,32 82.25,32.25
+12V
  pour Top (rank 3, no thermals): 92.5,26 92.5,29 91.5,29 90.5,28 87.25,28 87.25,26.5 90.5,26.5 91,26
  pour Top (rank 4, no thermals): 91,34.25 94,34.25 95.25,33 95.25,24 95,23.75 94.25,23.75 94,24 94,24.5 93.25,25.25 92.5,26 91.75,26 91.75,28.25 92.25,28.25 93.25,29.25 93.25,30.25 91,32.5
+12V_IN
  Top 0.25: 94.5,22 R5.1
  Top 0.75: X4.4 90.75,9.75 94.5,13.5 94.5,22
AIN1-FILT
  Top 0.2: 64.25,9.5 61.85,11.9 IC1.22
  Top 0.25: C15.1 71.75,8.5 71.25,8 71.25,7.75 70.75,7.25 R14.1 67.75,7.25 67.25,7.75 67.25,9.25 67,9.5 64.25,9.5
AIN2-FILT
  Top 0.2: 61,14.5 60.94,14.44 IC1.21
  Top 0.25: C17.1 71.75,15.5 71.25,16 71.25,16.25 70.75,16.75 R15.1 67.75,16.75 67.25,16.25 67.25,14.75 67,14.5 60.84,14.5 IC1.21
AIN3-FILT
  Top 0.2: R16.1 62.41,15.35 IC1.20
  Top 0.25: R16.1 66.25,15.35 C18.1
AIN4-FILT
  Top 0.2: R17.1 63.35,8.65 62.64,9.36 IC1.23
  Top 0.25: R17.1 66.25,8.65 C19.1
AIN-1  (via drill 0.35)
  Top 0.25: v55.25,8.5 55,8.5 52.75,10.75 44,10.75 43.5,11.25 43.5,13.23 X3.7
  Bottom 0.25: v55.25,8.5 R19.1
AIN-2
  Bottom 0.25: X3.1 53.86,14.54 55.4,13 R21.1
AIN-3
  Bottom 0.25: R23.1 55.75,11.5 54,13.25 48.5,13.25 47.25,14.5 47.25,14.52 X3.3
AIN-4  (via drill 0.35)
  Top 0.25: v55.25,10 52,13.25 46.02,13.25 X3.5
  Bottom 0.25: v55.25,10 R25.1
CAN-RX
  Top 0.2: IC1.4 75.81,14.44 74.75,15.5 74.75,22.65 75.5,23.4 76.65,23.4 77.25,24 77.25,26.25 77.9,26.9 R2.1
CAN-TX
  Top 0.2: IC1.3 77.5,13.38 77.5,23.5 78,24 78.4,24 R1.1
DAC1+  (via drill 0.35)
  Top 0.2: v69.25,26 69.06,26.2 IC3.14
  Bottom 0.2: X5.2 60,25.5 60.15,25.65 61.26,25.65 61.41,25.5 68.75,25.5 v69.25,26
DAC1-  (via drill 0.35)
  Top 0.2: v69,27.25 68.59,26.84 IC3.13
  Bottom 0.2: X5.1 46.5,26.75 48.75,26.75 49.5,26 59.95,26.05 60,26.1 61.35,26.1 61.45,26 68,26 69,27 v69,27.25
DAC2
  Top 0.2: X6.2 49.75,32 53.63,28.17 62.67,28.17 63.4,28.9 65.48,28.9 66.25,28.05 66.25,27.75 66.5,27.5 IC3.12
DAC3
  Top 0.2: X7.2 49.5,38.5 52.25,35.75 52.25,30.25 53.9,28.6 62.47,28.6 63.25,29.38 65.57,29.38 66.62,28.2 67.38,28.2 IC3.11
DAC_FS
  Top 0.2: IC3.7 75.14,28.8 IC1.10
DOUT1
  Top 0.25: IC1.15 60.6,29.5 54.5,29.5 53.1,30.9 R6.1
DOUT2
  Top 0.25: IC1.16 60.67,27.25 R7.1
DOUT3
  Top 0.25: IC1.17 59.63,25.75 R8.1 53.25,25.75
DOUT4
  Top 0.25: IC1.18 58.59,24.25 R9.1 53.25,24.25
GND  (via drill 0.35, 3.15 pad 6)  (1 unrouted)
  Top 0.25: SJ4.1 7.49,40.25 v7.5,40.25 | SJ1.1 7.49,30.75 v7.5,30.75 | SJ3.1 22.49,30.75 v22.5,30.75 | SJ2.1 22.49,40.25 v22.5,40.25 | R18.1 R24.1 R22.1 R20.1 40.71,19.45 v40.69,19.43
  Top 0.5: IC4.2 64.52,31.48 v64.75,31.63 | C9.2 55.9,32.6 R12.1 R11.1 v54.5,36
  Top 0.55: C6.2 74.14,14.86 v73.75,15.25
  Bottom 0.25: v40.69,19.43 40.32,19.43 40.25,19.5
  other vias: 68.6,12.4 64,22.25 65,22.25 71,20.75 72.5,30.25 71.25,30 69.25,9.25 69.25,8.25 84.12,26.5 85.01,26.99 86.01,26.99 67.25,30.25 65.75,5.25 62,5.25 89.75,38.75 89.75,37.75 84.75,34.5 84.75,33.25 84.75,32 21.5,30.75 6.5,30.75 6.5,40.25 21.5,40.25 86,24.75 90.5,24.5 3,36 3,6 98,6 98,36
  pour Bottom (rank 5): -0.5,41.5 101.5,41.5 101.5,0.5 -0.5,0.5
  pour Top (rank 5, no thermals): 63.5,24 67.5,24 67.5,23 67,22.5 67,21.5 63.75,21.5 63.5,21.75
  pour Top (rank 5, no thermals): 71.75,24 71.75,22.75 71.5,22.5 71.5,20.25 70.5,20.25 70.5,22.75 70.75,23 70.75,24
  pour Top (rank 5, no thermals): 70.5,31.25 70.5,29.75 72.25,28 73.25,28 73.25,29.5 71.25,31.5 70.5,31.5
  pour Top (rank 5, no thermals): 67.75,15.75 70.75,15.75 70.75,11.75 70.5,11.5 66.25,11.5 66,11.75 66,12.25 66.25,12.5 67.5,12.5 67.5,15.5
  pour Top (rank 5, no thermals): 70.75,8.25 70.75,9 70.25,9.5 68.25,9.5 67.75,9 67.75,8.25 68,8 70.5,8
  pour Top (no thermals): 84,28 86.25,28 86.25,26.5 86.75,26 90.25,26 91,25.25 92.75,25.25 92.75,24.25 89.5,24.25 88.75,25 86.75,25 86.25,24.25 83.75,24.25 83.75,27.75
  pour Top (rank 2, no thermals): 66.75,29.25 68.25,29.25 68.25,29.75 67.5,30.5 66.75,30.5
  pour Top (rank 2, no thermals): 62.5,5.75 61.75,5.75 61.5,5.5 61.5,5 62.5,4 62.5,3.75 65.25,3.75 65.25,4.25 66,5 66,5.5 65.75,5.75
  pour Top (rank 3, no thermals): 92.75,29.5 92.75,30.25 90.75,32.25 90.75,37 91,37.25 93,37.25 93,39.25 89,39.25 89,32 91.25,29.75 91.25,29.5
  pour Top (rank 3, no thermals): 81.5,30.75 83.5,30.75 84.25,31.5 84.25,34.75 85.5,34.75 85.5,31.25 83.5,29.25 81.5,29.25
N$1  (via drill 0.35)
  Top 0.25: 86.31,20.94 86.31,21.56 v87.25,22.5
  Top 0.75: D2.1 86.31,20.94 86.25,21 L1.1
  Bottom 0.25: v87.25,22.5 86.92,22.17 U$2.17
N$2  (via drill 0.35)
  Top 0.25: 83.75,21 84.5,20.25 85.25,20.25 85.5,20 88.5,20 89.5,19 v89.5,18.75
  Top 0.75: D1.2 83.69,20.94 83.75,21 L1.2
  Bottom 0.25: v89.5,18.75 89.46,18.79 U$2.15
N$3  (via drill 0.35)
  Bottom 0.5: U$2.19 84.38,18.62 85,18 85.04,18 85.14,17.91 92.12,17.91 92.12,17.97 C12.1
  other vias: 92.5,15 91.5,14.5
  pour Bottom (no thermals): 92.5,15.75 92.5,17.25 93,17.75 93,18.75 93.5,19.25 93.5,20.75 93,20.75 93,19.75 92,18.75 92,17.75 91.5,17.25 91.5,15.75
  pour Bottom (no thermals): 92.75,17.25 92.75,14.75 92.25,14.25 90.75,14.25 90.5,14.5 90.5,16.25 91.5,17.25
  pour Top (no thermals): 90,17.25 92.5,17.25 92.75,17 92.75,14.75 92.25,14.25 90.75,14.25 90,15
N$4  (via drill 0.35)
  Top 0.2: v80,26.5 80,25.75 79.75,25.5 78.6,25.5 R1.2
  Bottom 0.2: U$2.5 88.19,28.71 87.3,27.81 81.83,27.81 81.31,27.81 v80,26.5
N$5  (via drill 0.35)
  Top 0.2: v80,27.75 79.75,27.75 79,28.5 78.6,28.5 R2.2
  Bottom 0.2: U$2.4 86.92,28.45 86.66,28.19 81.83,28.19 80.44,28.19 v80,27.75
N$6
  pour Top (rank 2, no thermals): 90.75,29.75 88.75,31.75 87.25,31.75 87,31.5 87,29 86.75,28.75 86.75,28.25 88.75,28.25 89.25,28.75 90.75,28.75
N$7
  Top 0.4: IC2.1 83.16,28.41 84.75,30 C1.1
N$8
  Top 0.4: X4.2 85.75,9.75 83.75,11.75 L1.3
N$9
  Top 0.4: X4.3 88.25,10.94 X13.1 87.5,12.74 86.25,14 L1.4
  Bottom 0.4: R10.1 89.84,15.41 87.5,12.25 X13.1
N$10  (via drill 0.35)
  other vias: 25.25,17.5 28.25,17.5 26.75,16 29.5,16 28.25,14.5 29.5,13 28.25,11.75
  pour Top (no thermals): 27,7.5 27,13.5 24.25,16.25 20.75,16.25 20.75,18.25 30.25,18.25 30.25,7.5
  pour Bottom (no thermals): 27,7.5 27,13.5 24.25,16.25 20.75,16.25 20.75,18.25 30.25,18.25 30.25,7.5
N$11  (via drill 0.35)
  other vias: 23.5,15 24.75,13.75 26,12.5 24.75,11.25
  pour Top (rank 2, no thermals): 27,7.5 24,7.5 24,12.25 21.75,14.5 21.75,16.25 24.25,16.25 27,13.5 27,7.75 27.25,7.5
  pour Bottom (rank 2, no thermals): 27.25,7.5 24,7.5 24,12.25 21.75,14.5 21.75,16.25 24.25,16.25 27,13.5 27,7.75
N$12  (via drill 0.35)
  other vias: 11.25,17.75 13.25,17.75 12.5,16.5 13.75,15.25 15,14 14.75,16.5 13.75,12.75 15,11.5
  pour Bottom (no thermals): 13.25,7.75 13.25,13.75 10.5,16.5 7,16.5 7,18.5 16.5,18.5 16.5,7.75
  pour Top (no thermals): 13.25,7.75 13.25,13.75 10.5,16.5 7,16.5 7,18.5 16.5,18.5 16.5,7.75
N$13  (via drill 0.35)
  other vias: 10.75,14.75 11.75,13.5 11.75,11.75 10.75,12.75
  pour Bottom (rank 2, no thermals): 13.5,7.75 10.25,7.75 10.25,12.5 8,14.75 8,16.5 10.5,16.5 13.25,13.75 13.25,8
  pour Top (rank 2, no thermals): 13.5,7.75 10.25,7.75 10.25,12.5 8,14.75 8,16.5 10.5,16.5 13.25,13.75 13.25,8
N$14  (via drill 0.35)
  Top 0.75: K2.10 15.95,22.58 v15.92,22.61
  Bottom 0.5: T2.C 14.6,20.04 D6.CATHODE
  Bottom 0.75: v15.92,22.61 14.71,22.61 T2.C
N$15  (via drill 0.35)
  Top 0.75: v30,22.5 31.7,22.5 K1.10
  Bottom 0.5: T1.C 28.6,20.04 D4.CATHODE
  Bottom 0.75: T1.C v30,22.5
N$16  (via drill 0.35)
  Top 0.2: v34,21.25 25.25,21.25 v25,21.5
  Bottom 0.2: R4.2 71.25,4.25 70,3 35.75,3 34,4.75 v34,21.25 | v25,21.5 26.35,21.5 T1.B
N$17  (via drill 0.35)
  Top 0.25: R3.2 51,22.75 49.5,24.25 47,24.25 46.5,24.75 46.5,27.25 45,28.75 42.75,28.75 38.5,33 26.5,33 25.5,32 14.25,32 12.5,30.25 12.5,27.25 v10.5,25.25
  Bottom 0.25: v10.5,25.25 10.5,22.5 11.25,21.75 12.2,21.75 T2.B
N$18
  Bottom 0.4: R10.2 87.94,15.47 X13.2
N$19
  Top 0.25: IC5.6 IC5.7 72.35,14 72.75,14 73,14.25 73,16.5 72.75,16.75 R15.2
N$20
  Top 0.25: IC5.2 IC5.1 73.25,9.1 73.25,8 72.5,7.25 R14.2
N$21  (via drill 0.35)
  Top 0.2: v63.7,11.3 63.75,11.35 IC5.12
  Top 0.25: R24.2 48.53,16.5 56.25,16.5 v56.75,16 | v59,16 59.5,15.5 59.5,13.5 59.75,13.25 61.5,13.25 63.45,11.3 v63.7,11.3
  Bottom 0.2: R25.2 59.15,10.8 61.7,10.8 62.2,11.3 v63.7,11.3
  Bottom 0.25: v56.75,16 v59,16
N$22
  pour Bottom (no thermals): 28.25,39.25 27.75,38.75 27.75,38 28,37.75 35.25,37.75 35.5,38 35.5,39.5 35.25,39.75 28.75,39.75
N$23  (via drill 0.35)
  other vias: 31.75,35.25 32.75,35.25 35,35.25 36.25,35.25
  pour Top (rank 2, no thermals): 25.5,39.25 25.5,37.25 27.5,35.25 31,35.25 31.75,34.5 36,34.5 36.5,35 36.5,37.25 28.5,37.25 27.75,38 27.75,39 27.5,39.25
  pour Bottom (rank 2, no thermals): 35.5,37.25 34.75,37.25 34,36.5 31.5,36.5 31.5,34.75 31.75,34.5 36,34.5 36.5,35 36.5,37.25
  pour Top (no thermals): 21.25,38.75 25,38.75 25.5,39.25 27,39.25 27,37.75 21.25,37.75
N$24
  pour Bottom (no thermals): 12.75,28.25 13,28 14.5,28 14.75,28.25 14.75,35 14.5,35.25 13,35.25 12.75,35
N$25
  pour Bottom (rank 2, no thermals): 10.25,28.25 10.5,28 12,28 12.25,28.25 12.25,35 12,35.25 10.5,35.25 10.25,35
  pour Top (no thermals): 12,29.75 8.25,29.75 7.75,29.25 6.25,29.25 6.25,28.25 12,28.25
N$26
  pour Bottom (no thermals): 27.75,28.25 28,28 29.5,28 29.75,28.25 29.75,35 29.5,35.25 28,35.25 27.75,35
N$27
  pour Bottom (rank 2, no thermals): 25.25,28.25 25.5,28 27,28 27.25,28.25 27.25,35 27,35.25 25.5,35.25 25.25,35
  pour Top (no thermals): 21.25,29.25 25,29.25 25.5,29.75 27,29.75 27,28.25 21.25,28.25
N$28
  pour Bottom (no thermals): 13.25,39.25 12.75,38.75 12.75,38 13,37.75 20.25,37.75 20.5,38 20.5,39.5 20.25,39.75 13.75,39.75
N$29  (via drill 0.35)
  other vias: 17,35.25 18.25,35.25 20.25,35.25 21.25,35.25
  pour Top (rank 2, no thermals): 10.5,39.25 10.5,37.25 12.5,35.25 16,35.25 16.75,34.5 21,34.5 21.5,35 21.5,37.25 13.5,37.25 12.75,38 12.75,39 12.5,39.25
  pour Bottom (rank 2, no thermals): 20.5,37.25 19.75,37.25 19,36.5 16.5,36.5 16.5,34.75 16.75,34.5 21,34.5 21.5,35 21.5,37.25
  pour Top (no thermals): 12,39.25 8.25,39.25 7.75,38.75 6.25,38.75 6.25,37.75 12,37.75
N$30  (via drill 0.35)
  Top 0.2: R6.2 39.75,34.75 36.75,37.75 v32.75,37.75
  Bottom 0.2: 34.25,36.45 T3.B 32.95,37.75 v32.75,37.75
N$31  (via drill 0.35)
  Top 0.25: R7.2 48.4,30.5 43.25,30.5 39.25,34.5 v9.75,34.5
  Bottom 0.25: v9.75,34.5 10.7,35.45 T4.B
N$32  (via drill 0.35)
  Top 0.25: R8.2 47.4,30 43,30 39,34 25,34 v24.5,33.5
  Bottom 0.25: v24.5,33.5 24.5,34.25 25.5,35.25 26.2,35.25 T5.B
N$34
  Top 0.2: R16.2 65.35,13.3 IC5.9
  Top 0.25: IC5.9 IC5.8
N$35
  Top 0.2: R17.2 65.3,10.05 IC5.14
  Top 0.25: IC5.14 IC5.13
N$36  (via drill 0.35)
  Top 0.2: IC5.10 65.25,12.65 v64.9,12.3
  Top 0.25: R22.2 46.49,16 55.25,16 56.5,14.75 v56.75,14.75 | v58.75,14.75 59,14.5 v59,11.5
  Bottom 0.2: R23.2 59.85,13 64.2,13 v64.9,12.3
  Bottom 0.25: v56.75,14.75 v58.75,14.75 | v59,11.5 R23.2
N$37  (via drill 0.35)
  Top 0.2: v69.8,13.4 70.35,13.4 71.1,12.65 IC5.5
  Top 0.25: R20.2 43.95,16 v45,16
  Bottom 0.2: R21.2 58.8,13 59.2,13.4 v69.8,13.4
  Bottom 0.25: v45,16 53.75,16 55.75,14 57.5,14 58.35,13.15 R21.2
N$38  (via drill 0.35)
  Top 0.2: v69.8,11.4 69.85,11.35 IC5.3
  Top 0.25: R18.2 49.82,17.18 50,17 57.25,17 58,16.25 v58,7.25
  Bottom 0.2: R19.2 58.5,8.5 58.75,8.5 59.5,9.25 59.5,9.8 60.1,10.4 64,10.4 65,11.4 v69.8,11.4
  Bottom 0.25: v58,7.25 58,8 58.5,8.5
N$46  (via drill 0.35)
  Top 0.25: R9.2 51.25,24.5 46.5,29.25 43,29.25 38.75,33.5 26,33.5 25,32.5 24,32.5 22.5,34 20.5,34 v20,33.5
  Bottom 0.25: v20,33.5 19.25,34.25 19.25,36.45 T6.B
RELAY1
  Bottom 0.2: IC1.0 73.88,4.28 R4.1
RELAY2
  Top 0.25: IC1.19 60.78,19.72 57.75,22.75 R3.1
SPI_MOSI  (via drill 0.35)
  Top 0.2: IC3.4 74.34,26.84 v74.5,27
  Bottom 0.2: v74.5,27 74.5,30.7 IC1.11
SPI_SCLK  (via drill 0.35)
  Top 0.25: v70.5,28.5 70.75,28.5 71.75,27.5 IC3.5
  Bottom 0.25: IC1.13 60.78,34.72 62.25,33.25 64.25,33.25 65.75,31.75 65.75,31 65.5,30.75 65.5,28.5 65.75,28.25 69.5,28.25 v70.5,28.5
VTHERM
  Top 0.25: R13.1 56.4,31.25 56.5,31.25 57.6,32.35 57.6,32.6
  Top 0.5: IC1.14 57.98,32.22 C9.1 57.6,32.6 R12.2 R11.2

### Text on the board
tPlace: 4 | 1 | DAC3 | SWITCH | DAC2 | 2 | 3 | DAC1 | - | + | AIN | AIN | 1 | 2 | 3 | 4 | K1 | K2
bPlace: Magic Camper Node v1.0